# Altium schematic sheet BV100011_ControlPower.SchDoc
size Tabloid
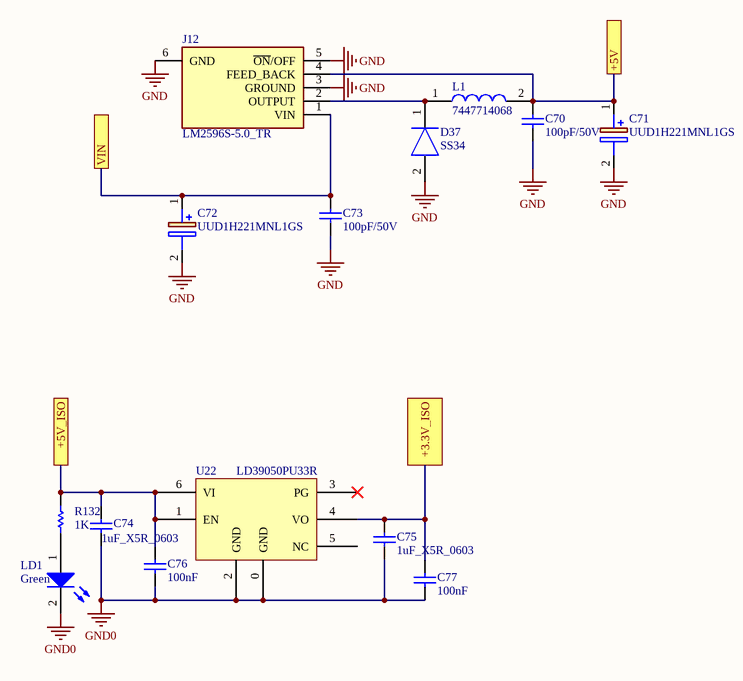
[diagram p0: BV100011_ControlPower.SchDoc]

## Parts
C70  100pF/50V  [C1210]
C71  UUD1H221MNL1GS  [CAPAE1030X1050N]
C72  UUD1H221MNL1GS  [CAPAE1030X1050N]
C73  100pF/50V  [C1210]
C74  1uF_X5R_0603  [0603C]
C75  1uF_X5R_0603  [0603C]
C76  100nF  [0603C]
C77  100nF  [0603C]
D37  SS34  [DIOM6959X262N]
J12  LM2596S-5.0_TR  [LM2596S50TR]
L1  7447714068  [WE-PD_1030/105054]
LD1  Green  [0603D-G]
R132  1K  [0603R]
U22  LD39050PU33R  [DFN6_0R95_3x3_TP]

## Ports
+3.3V_ISO, +5V, +5V_ISO, VIN

## Nets
GND: C70.1 C71.2(-) C72.2(-) C73.1 D37.2(A) J12.3(GROUND) J12.5(~{ON}/OFF) J12.6(GND)
GND0: C74.2 C75.2 C76.1 C77.1 LD1.2(K) U22.0(GND) U22.2(GND)
+3.3V_ISO: C75.1 C77.2 U22.4(VO) ; port +3.3V_ISO
+5V: C70.2 C71.1(+) J12.4(FEED_BACK) L1.2 ; port +5V
+5V_ISO: C74.1 C76.2 R132.2 U22.1(EN) U22.6(VI) ; port +5V_ISO
VIN: C72.1(+) C73.2 J12.1(VIN) ; port VIN
NetD37_1: D37.1(K) J12.2(OUTPUT) L1.1
NetLD1_1: LD1.1(A) R132.1

Not connected (* = marked no-connect by the designer): U22 3(PG)* 5(NC)

## Library data of the parts
C70 C73 = Cap Semi: Capacitor (Semiconductor SIM Model); Published: 8-Jun-2000; LatestRevisionDate: 29-May-2009; LatestRevisionNote: IPC-7351 Footprint Added.; PackageReference: C1206; Publisher: Altium Limited; PackageDescription: Chip Capacitor; Value: 100pF/50V
C71 C72 = UUD1H221MNL1GS: Capacitor Polarised; Manufacturer_Name: Nichicon; Datasheet Link: https://componentsearchengine.com/Datasheets/2/UUD1H221MNL1GS.pdf; Height: 10.5mm; Manufacturer_Part_Number: UUD1H221MNL1GS; Arrow Part Number: UUD1H221MNL1GS; Arrow Price/Stock: https://www.arrow.com/en/products/uud1h221mnl1gs/nichicon; Mouser Part Number: 647-UUD1H221MNL; Mouser Price/Stock: https://www.mouser.co.uk/ProductDetail/Nichicon/UUD1H221MNL1GS?qs=vtpzqDgAobnaECklx3mHVg%3D%3D
C74 C75 = CAP SMD 0603  X5R 1µF 25V 10%: 0603  X5R 1µF; Rated voltage: 25V; Tolerance: 10%; Manufacturer: *; Manufacturer P/N: *; Order code Farnell: 1288202RL; Value: 1µF; Power: *; Technology: X5R; Temperature  Factor: *; Temperature Max: +125°C; Temperature Min: -55°C; STS Code: *
C76 C77 = Capacitor_ST: Capacitor 0402 / 0603 / 0805; Revision: July-2002: Re-released for DXP Platform.; Value: 100nF
D37 = SS34: Diode; Manufacturer_Name: HY Electronic Corp; Datasheet Link: http://www.hygroup.com.tw/upfiles/ADUpload/all_/SS32%20thru%20SS310(242-243).pdf; Height: 2.62mm; Manufacturer_Part_Number: SS34
J12 = LM2596S-5.0_TR: Connector; Manufacturer_Name: National Electronics; Manufacturer_Part_Number: LM2596S-5.0/TR; Datasheet Link: https://www.jameco.com/Jameco/Products/ProdDS/895246.pdf; Height: 4.65mm
L1 = 7447714068: Inductor; Manufacturer_Name: Wurth Elektronik; Manufacturer_Part_Number: 7447714068; Mouser Part Number: 710-7447714068; Mouser Price/Stock: https://www.mouser.com/Search/Refine.aspx?Keyword=710-7447714068
LD1 = LED2: Typical RED, GREEN, YELLOW, AMBER GaAs LED; Published: 8-Jun-2000; Revision: July-2002: Re-released for DXP Platform.; Publisher: Altium Limited
R132 = Resistor_ST: Resistor 0402 / 0603 / 0805; Value: 10K
U22 = LD39050P